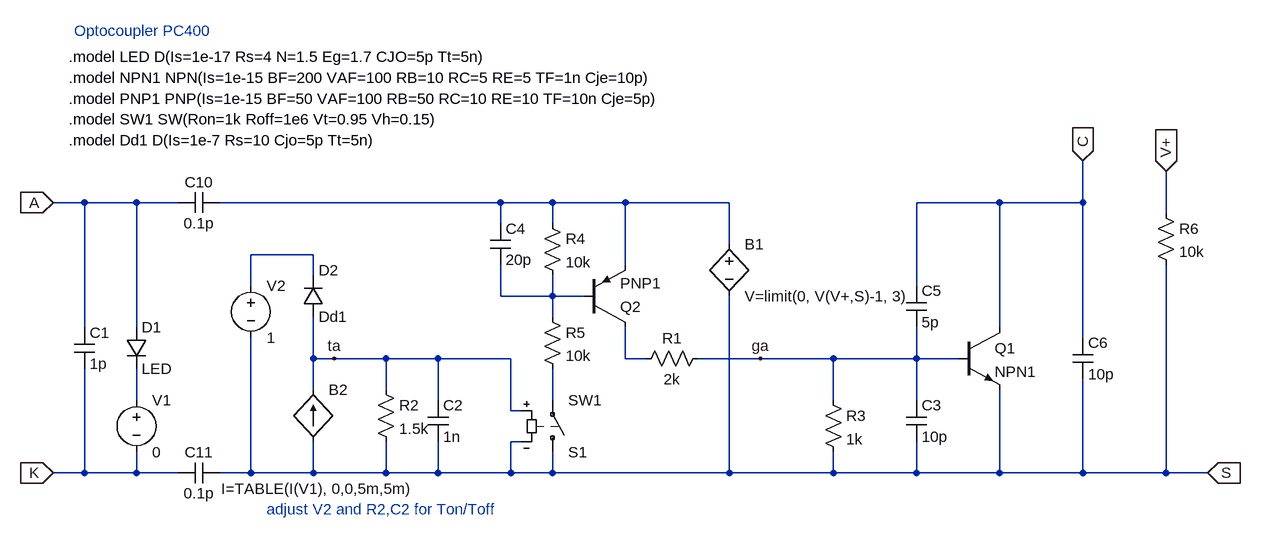
[diagram p0: schematic pc400_hy.asc]
pc400_hy.asc, the LTspice schematic file:
Version 4
SHEET 1 1728 872
WIRE -96 128 -144 128
WIRE -16 128 -96 128
WIRE 48 128 -16 128
WIRE 544 128 112 128
WIRE 624 128 544 128
WIRE 736 128 624 128
WIRE 896 128 736 128
WIRE 1312 128 1184 128
WIRE 1440 128 1440 64
WIRE 1440 128 1312 128
WIRE 1568 144 1568 80
WIRE 544 160 544 128
WIRE 624 160 624 128
WIRE 896 192 896 128
WIRE 256 208 160 208
WIRE 736 224 736 128
WIRE 256 240 256 208
WIRE 160 256 160 208
WIRE 1184 256 1184 128
WIRE 544 272 544 224
WIRE 624 272 624 240
WIRE 624 272 544 272
WIRE 672 272 624 272
WIRE 624 304 624 272
WIRE -96 320 -96 128
WIRE -16 320 -16 128
WIRE 1312 320 1312 128
WIRE 1440 336 1440 128
WIRE 256 368 256 304
WIRE 288 368 256 368
WIRE 368 368 288 368
WIRE 448 368 368 368
WIRE 560 368 448 368
WIRE 736 368 736 320
WIRE 768 368 736 368
WIRE 944 368 848 368
WIRE 1056 368 944 368
WIRE 1184 368 1184 320
WIRE 1184 368 1056 368
WIRE 1248 368 1184 368
WIRE 256 416 256 368
WIRE 368 416 368 368
WIRE -16 432 -16 384
WIRE 448 432 448 368
WIRE 624 432 624 384
WIRE 1056 432 1056 368
WIRE 1184 432 1184 368
WIRE 560 448 560 368
WIRE 576 448 560 448
WIRE 576 496 560 496
WIRE -96 544 -96 384
WIRE -96 544 -144 544
WIRE -16 544 -16 512
WIRE -16 544 -96 544
WIRE 48 544 -16 544
WIRE 160 544 160 336
WIRE 160 544 112 544
WIRE 256 544 256 496
WIRE 256 544 160 544
WIRE 368 544 368 496
WIRE 368 544 256 544
WIRE 448 544 448 496
WIRE 448 544 368 544
WIRE 560 544 560 496
WIRE 560 544 448 544
WIRE 624 544 624 512
WIRE 624 544 560 544
WIRE 896 544 896 272
WIRE 896 544 624 544
WIRE 1056 544 1056 512
WIRE 1056 544 896 544
WIRE 1184 544 1184 496
WIRE 1184 544 1056 544
WIRE 1312 544 1312 416
WIRE 1312 544 1184 544
WIRE 1440 544 1440 400
WIRE 1440 544 1312 544
WIRE 1568 544 1568 224
WIRE 1568 544 1440 544
WIRE 1632 544 1568 544
FLAG -144 128 A
IOPIN -144 128 In
FLAG -144 544 K
IOPIN -144 544 In
FLAG 1632 544 S
IOPIN 1632 544 In
FLAG 1440 64 C
IOPIN 1440 64 In
FLAG 944 368 ga
FLAG 288 368 ta
FLAG 1568 80 V+
IOPIN 1568 80 In
SYMBOL diode -32 320 R0
SYMATTR InstName D1
SYMATTR Value LED
SYMBOL cap -112 320 R0
SYMATTR InstName C1
SYMATTR Value 1p
SYMBOL voltage -16 416 R0
SYMATTR InstName V1
SYMATTR Value 0
SYMBOL res 352 400 R0
SYMATTR InstName R2
SYMATTR Value 1.5k
SYMBOL cap 432 432 R0
SYMATTR InstName C2
SYMATTR Value 1n
SYMBOL bi2 256 416 R0
WINDOW 3 -142 152 Left 0
SYMATTR Value I=TABLE(I(V1), 0,0,5m,5m)
SYMATTR InstName B2
SYMBOL cap 48 144 R270
WINDOW 0 32 32 VTop 0
WINDOW 3 0 32 VBottom 0
SYMATTR InstName C10
SYMATTR Value 0.1p
SYMBOL cap 48 560 R270
WINDOW 0 32 32 VTop 0
WINDOW 3 0 32 VBottom 0
SYMATTR InstName C11
SYMATTR Value 0.1p
SYMBOL cap 1168 256 R0
SYMATTR InstName C5
SYMATTR Value 5p
SYMBOL cap 1424 336 R0
SYMATTR InstName C6
SYMATTR Value 10p
SYMBOL res 1040 416 R0
SYMATTR InstName R3
SYMATTR Value 1k
SYMBOL cap 1168 432 R0
SYMATTR InstName C3
SYMATTR Value 10p
SYMBOL npn 1248 320 R0
SYMATTR InstName Q1
SYMATTR Value NPN1
SYMBOL pnp 672 320 M180
SYMATTR InstName Q2
SYMATTR Value PNP1
SYMBOL res 752 384 R270
WINDOW 0 32 56 VTop 0
WINDOW 3 0 56 VBottom 0
SYMATTR InstName R1
SYMATTR Value 2k
SYMBOL res 608 144 R0
SYMATTR InstName R4
SYMATTR Value 10k
SYMBOL res 608 288 R0
SYMATTR InstName R5
SYMATTR Value 10k
SYMBOL sw 624 528 M180
SYMATTR InstName S1
SYMATTR Value SW1
SYMBOL bv 896 176 R0
SYMATTR InstName B1
SYMATTR Value V=limit(0, V(V+,S)-1, 3)
SYMBOL res 1552 128 R0
SYMATTR InstName R6
SYMATTR Value 10k
SYMBOL cap 528 160 R0
SYMATTR InstName C4
SYMATTR Value 20p
SYMBOL diode 240 304 M180
WINDOW 0 24 72 Left 0
WINDOW 3 24 0 Left 0
SYMATTR InstName D2
SYMATTR Value Dd1
SYMBOL voltage 160 240 R0
SYMATTR InstName V2
SYMATTR Value 1
TEXT -120 -96 Left 0 !.model LED D(Is=1e-17 Rs=4 N=1.5 Eg=1.7 CJO=5p Tt=5n)
TEXT -112 -136 Left 0 ;Optocoupler PC400
TEXT -120 -64 Left 0 !.model NPN1 NPN(Is=1e-15 BF=200 VAF=100 RB=10 RC=5 RE=5 TF=1n Cje=10p)
TEXT -120 32 Left 0 !.model Dd1 D(Is=1e-7 Rs=10 Cjo=5p Tt=5n)
TEXT -120 -32 Left 0 !.model PNP1 PNP(Is=1e-15 BF=50 VAF=100 RB=50 RC=10 RE=10 TF=10n Cje=5p)
TEXT -120 0 Left 0 !.model SW1 SW(Ron=1k Roff=1e6 Vt=0.95 Vh=0.15)
TEXT 184 600 Left 0 ;adjust V2 and R2,C2 for Ton/Toff

The netlist it stands for:
* pc400_hy.asc
D1 A N005 LED
C1 A K 1p
V1 N005 K 0
R2 ta S 1.5k
C2 ta S 1n
B2 S ta I=TABLE(I(V1), 0,0,5m,5m)
C10 A N001 0.1p
C11 K S 0.1p
C5 C ga 5p
C6 C S 10p
R3 ga S 1k
C3 ga S 10p
Q1 C ga S 0 NPN1
Q2 N004 N003 N001 0 PNP1
R1 N004 ga 2k
R4 N001 N003 10k
R5 N003 N006 10k
S1 S N006 ta S SW1
B1 N001 S V=limit(0, V(V+,S)-1, 3)
R6 V+ S 10k
C4 N001 N003 20p
D2 ta N002 Dd1
V2 N002 S 1
.model D D
.lib standard.dio
.model NPN NPN
.model PNP PNP
.lib standard.bjt
.model LED D(Is=1e-17 Rs=4 N=1.5 Eg=1.7 CJO=5p Tt=5n)
* Optocoupler PC400
.model NPN1 NPN(Is=1e-15 BF=200 VAF=100 RB=10 RC=5 RE=5 TF=1n Cje=10p)
.model Dd1 D(Is=1e-7 Rs=10 Cjo=5p Tt=5n)
.model PNP1 PNP(Is=1e-15 BF=50 VAF=100 RB=50 RC=10 RE=10 TF=10n Cje=5p)
.model SW1 SW(Ron=1k Roff=1e6 Vt=0.95 Vh=0.15)
* adjust V2 and R2,C2 for Ton/Toff
.backanno
.end